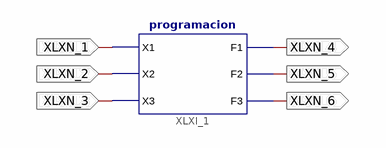
[diagram p0: schematic sheet 1]
// Xilinx ISE schematic esquema.sch (xbr) as structural Verilog: 1 symbols, 6 ports
module esquema (
  input  XLXN_1,
  input  XLXN_2,
  input  XLXN_3,
  output XLXN_4,
  output XLXN_5,
  output XLXN_6
);

  programacion XLXI_1 (.X1(XLXN_1), .X2(XLXN_2), .X3(XLXN_3), .F1(XLXN_4), .F2(XLXN_5), .F3(XLXN_6));
endmodule
